# EAGLE design new_remote_pcb (EAGLE 6.6.0)
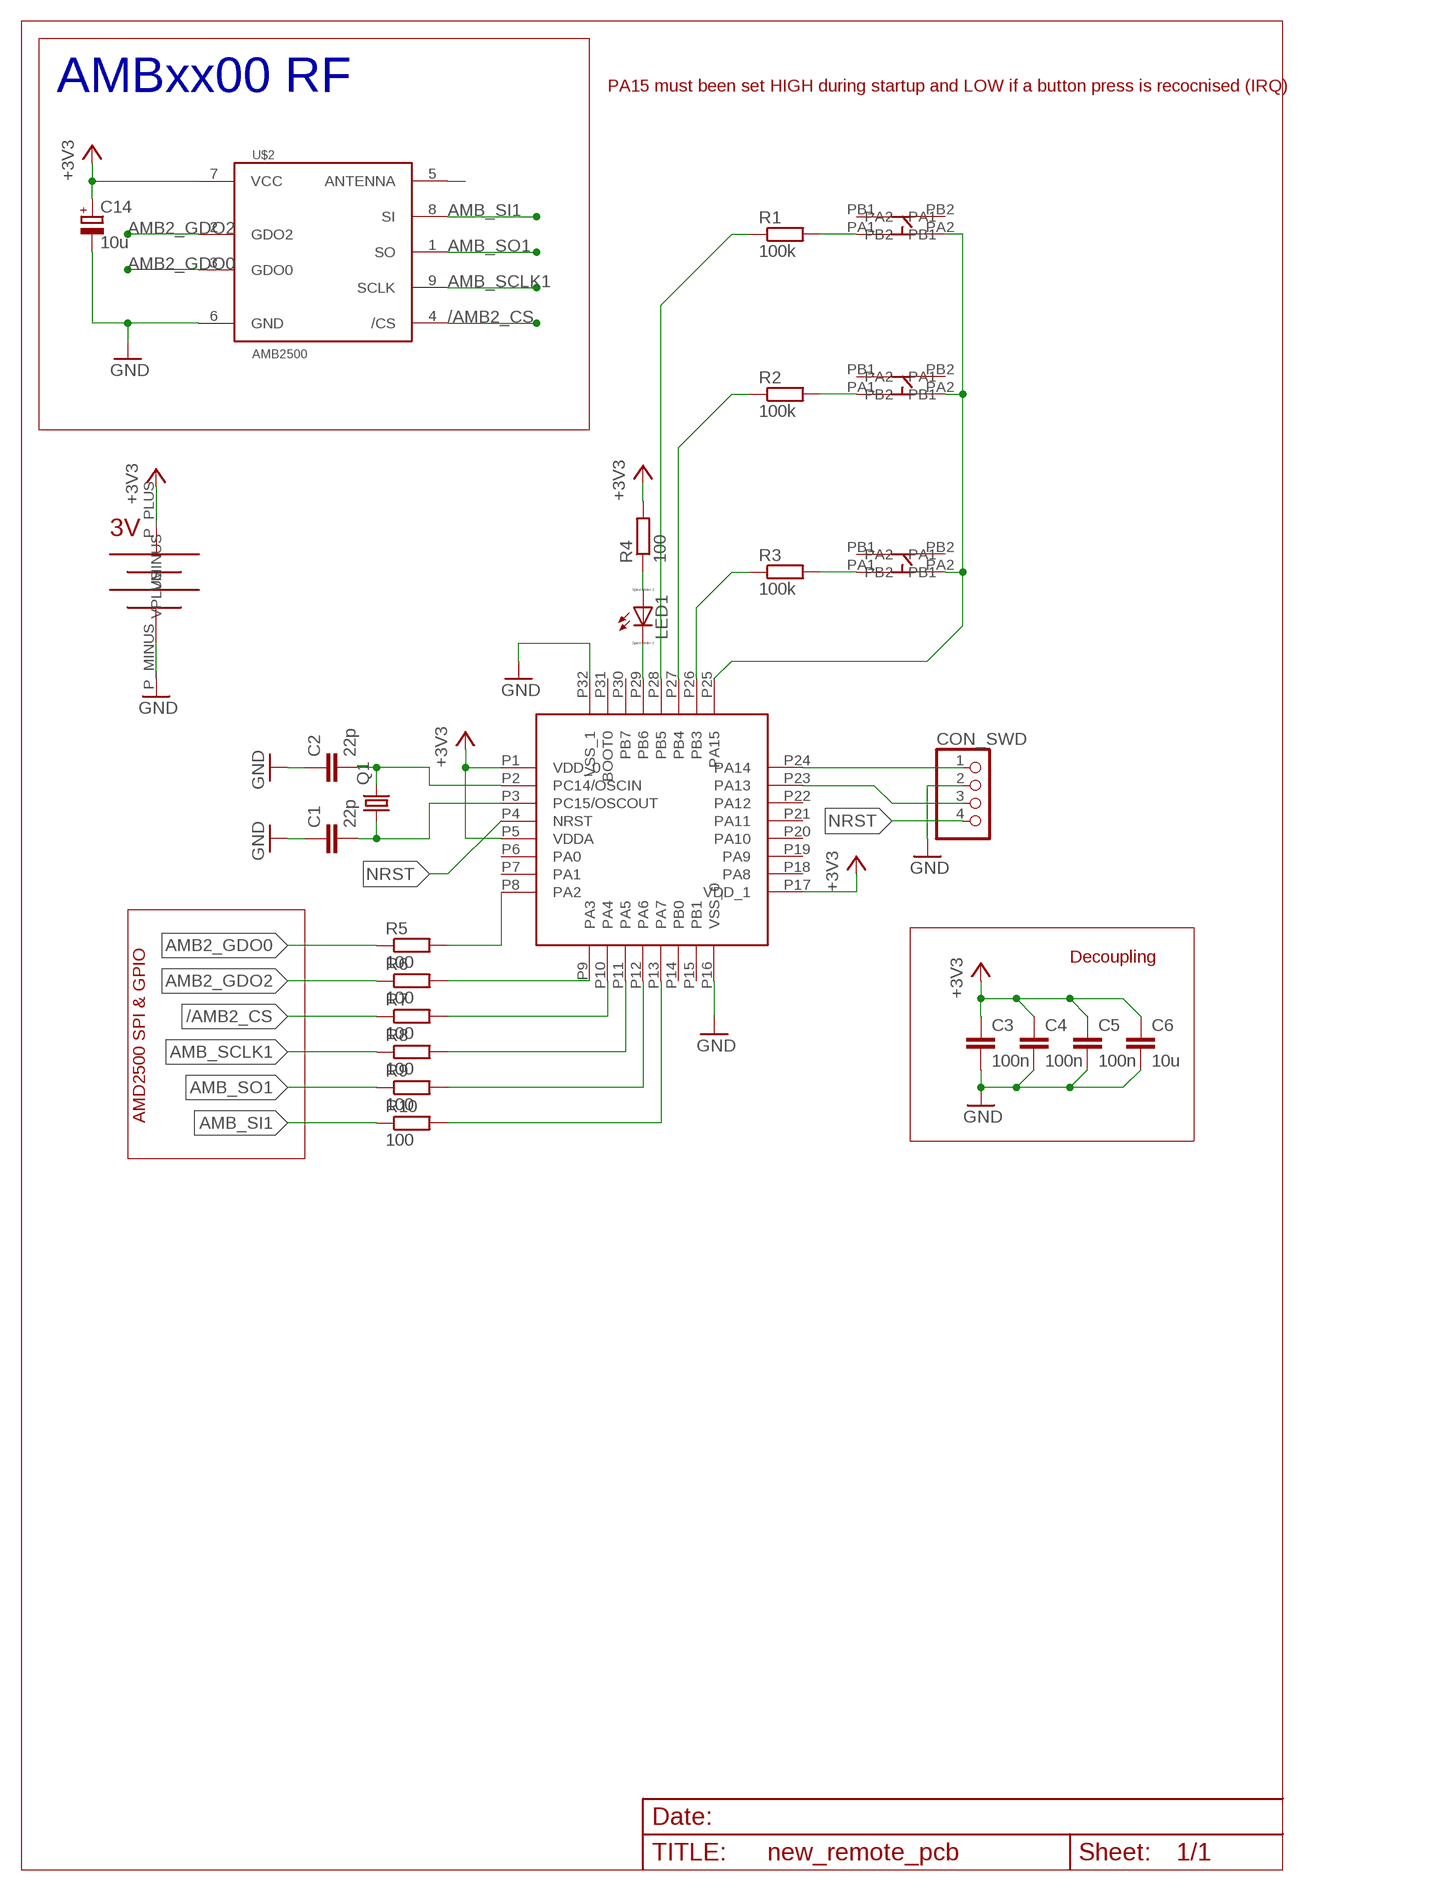
[diagram p0: schematic, sheet 1]

## Parts
C1  22p  C-EUC0805K  [C0805K]
C2  22p  C-EUC0805K  [C0805K]
C3  100n  C-EUC0805  [C0805]
C4  100n  C-EUC0805  [C0805]
C5  100n  C-EUC0805  [C0805]
C6  10u  C-EUC0805  [C0805]
C14  10u  CPOL-EUA/3216-18W  [A/3216-18W]
CON_SWD  PINHD-1X4  [1X04]
LED1  LED_E  [LED_1206]
Q1  CRYSTALHC49UP  [HC49UP]
R1  100k  R-EU_R0805W  [R0805W]
R2  100k  R-EU_R0805W  [R0805W]
R3  100k  R-EU_R0805W  [R0805W]
R4  100  R-EU_R0805W  [R0805W]
R5  100  R-EU_R0805  [R0805]
R6  100  R-EU_R0805  [R0805]
R7  100  R-EU_R0805  [R0805]
R8  100  R-EU_R0805  [R0805]
R9  100  R-EU_R0805  [R0805]
R10  100  R-EU_R0805  [R0805]
U$1  STM32L051K8T6  [LQFP32]
U$2  AMB2500  AMB8400  [AMB8400]
U$3  KEYSTONE_2462  [2462]
U$4  C&K_KSC_BUTTONS  [C&K_KSC9]
U$5  C&K_KSC_BUTTONS  [C&K_KSC9]
U$6  C&K_KSC_BUTTONS  [C&K_KSC9]

## Nets
+3V3: C3.1 C4.1 C5.1 C6.1 C14.+ R4.2 U$1.P1(VDD_0) U$1.P5(VDDA) U$1.P17(VDD_1) U$2.7(VCC) U$3.P_PLUS(VPLUS)
/AMB2_CS: R7.1 U$2.4(/CS)
/AMB2_CS_UC: R7.2 U$1.P10(PA4)
AMB2_GDO0: R5.1 U$2.3(GDO0)
AMB2_GDO0_UC: R5.2 U$1.P8(PA2)
AMB2_GDO2: R6.1 U$2.2(GDO2)
AMB2_GDO2_UC: R6.2 U$1.P9(PA3)
AMB_SCLK1: R8.1 U$2.9(SCLK)
AMB_SCLK1_UC: R8.2 U$1.P11(PA5)
AMB_SI1: R10.1 U$2.8(SI)
AMB_SI1_UC: R10.2 U$1.P13(PA7)
AMB_SO1: R9.1 U$2.1(SO)
AMB_SO1_UC: R9.2 U$1.P12(PA6)
GND: C1.1 C2.1 C3.2 C4.2 C5.2 C6.2 C14.- CON_SWD.2 U$1.P16(VSS_0) U$1.P32(VSS_1) U$2.6(GND) U$3.P_MINUS(VMINUS)
N$1: U$1.P25(PA15) U$4.PA2(PB2) U$5.PA2(PB2) U$6.PA2(PB2)
N$2: R1.2 U$4.PA1(PB1)
N$3: R2.2 U$5.PA1(PB1)
N$4: R3.2 U$6.PA1(PB1)
N$5: R3.1 U$1.P26(PB3)
N$6: R2.1 U$1.P27(PB4)
N$7: R1.1 U$1.P28(PB5)
N$8: LED1.A R4.1
N$9: U$2.5(ANTENNA)
N$10: LED1.C U$1.P29(PB6)
N$11: C1.2 Q1.1 U$1.P3(PC15/OSCOUT)
N$12: C2.2 Q1.2 U$1.P2(PC14/OSCIN)
N$13: CON_SWD.1 U$1.P24(PA14)
N$14: CON_SWD.3 U$1.P23(PA13)
NRST: CON_SWD.4 U$1.P4(NRST)
Unconnected: U$1.P6(PA0) U$1.P7(PA1) U$1.P14(PB0) U$1.P15(PB1) U$1.P18(PA8) U$1.P19(PA9) U$1.P20(PA10) U$1.P21(PA11) U$1.P22(PA12) U$1.P30(PB7) U$1.P31(BOOT0) U$4.PB1(PA1) U$4.PB2(PA2) U$5.PB1(PA1) U$5.PB2(PA2) U$6.PB1(PA1) U$6.PB2(PA2)

## Notes on the sheet
- AMBxx00 RF | PA15 must been set HIGH during startup and LOW if a button press is recocnised (IRQ)
- Decoupling
- AMD2500 SPI & GPIO

## Library data of the parts
C1 C2 = rcl:C-EU: CAPACITOR, European symbol
C3-C6 = resistor:C-EU: CAPACITOR, European symbol
C14 = rcl:CPOL-EU: POLARIZED CAPACITOR, European symbol
CON_SWD = pinhead:PINHD-1X4: PIN HEADER
LED1 = eagle-ltspice:LED_E: LED Source: http://www.osram.convergy.de Source: www.luxeon.com Source: www.kingbright.com; SPICEMODEL: NONE; SPICEPREFIX: D; SPICETYPE: diode
Q1 = crystal:CRYSTAL: CRYSTAL; OC_FARNELL: unknown; OC_NEWARK: unknown
R1-R4 = rcl:R-EU_: RESISTOR, European symbol
R5-R10 = resistor:R-EU_: RESISTOR, European symbol
U$1 = STM32L0xx:STM32L051K8T6
U$2 = Amber-Wireless:AMB8400
U$3 = Battery_holder:KEYSTONE_2462
U$4-U$6 = button:C&K_KSC_BUTTONS

## Board
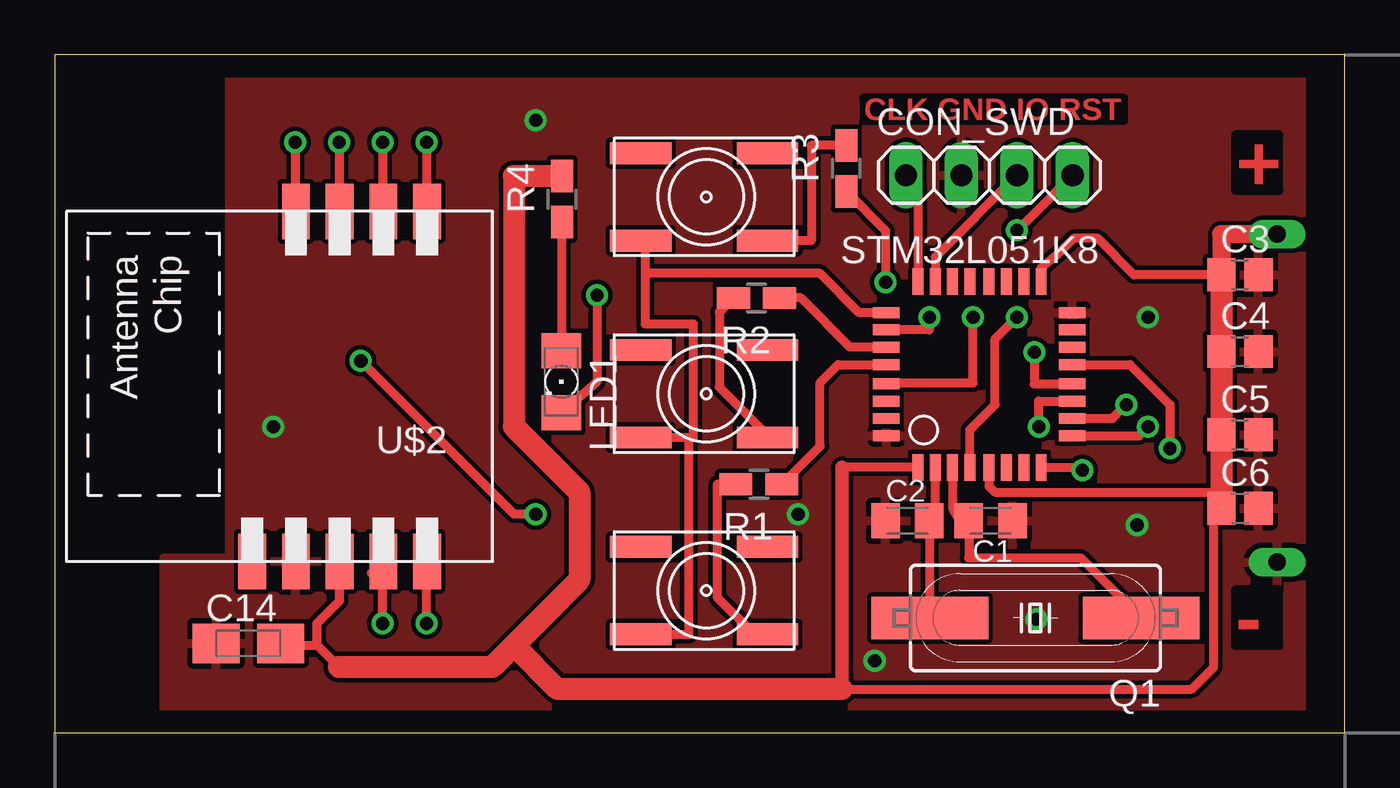
[diagram p1: board, top side]
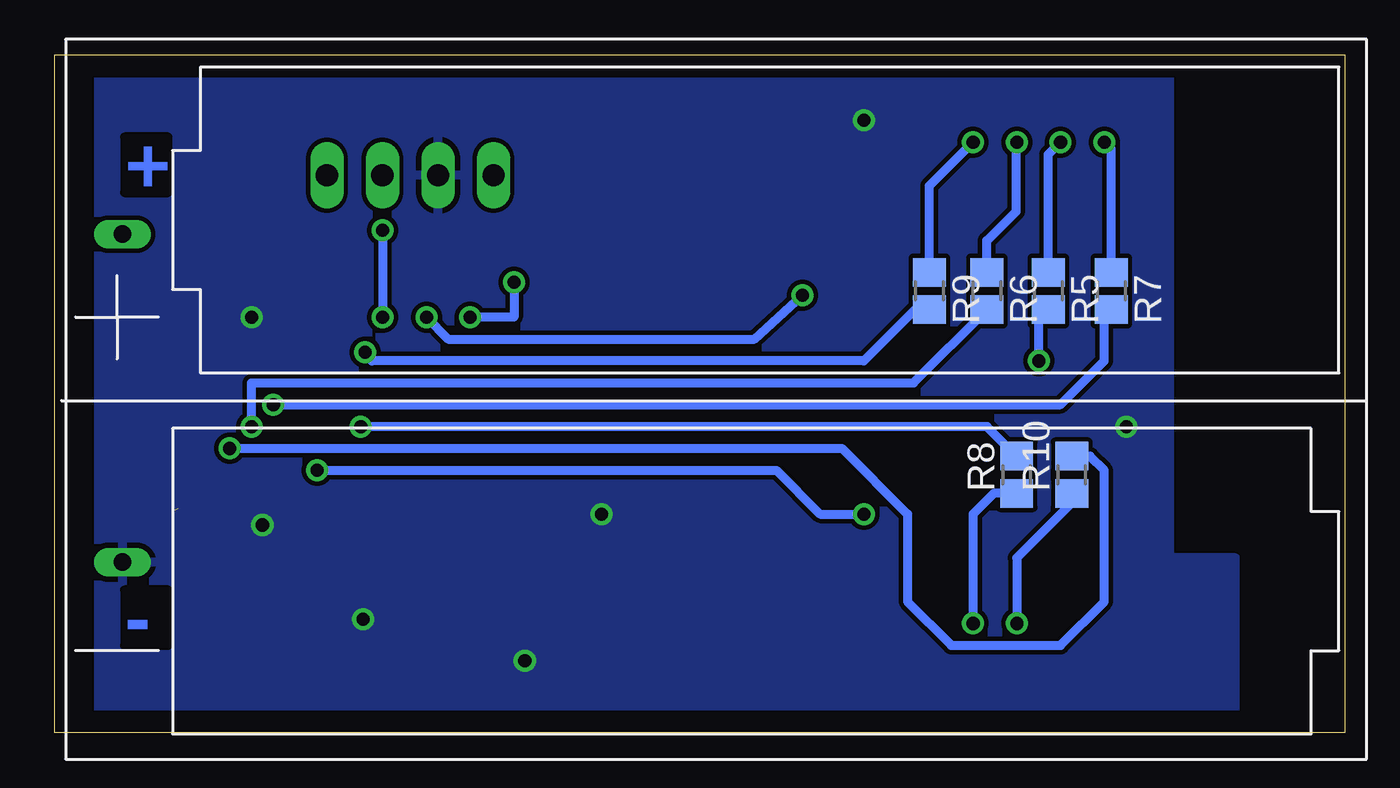
[diagram p2: board, bottom side, seen from below]

Size 59 x 31 mm. Coordinates in mm from the lower left corner, seen from the top.
Outline: 0,0 59,0 59,31 0,31 0,0
Copper layers (1*16): Top 0.035mm / dielectric 1.5mm / Bottom 0.035mm
Design rules "default": minimum track width 10mil, minimum drill 24mil, track to track 8mil, track to pad 8mil, pad to pad 8mil, via to via 8mil, smd to smd 8mil, copper to edge 40mil, drill to drill 8mil, minimum pad ring 10mil, minimum via ring 8mil, stop-mask expansion 4mil, vias tented up to drill 0mil, thermal gap 10mil

### Footprints (pad centres in the part's own frame; a part is rotated, then mirrored left to right if it is on the bottom)
C0805K = smd 1.3 x 1.6: 1 -1,0; 2 1,0
C0805 = smd 1.3 x 1.5: 1 -0.85,0; 2 0.85,0
A/3216-18W = smd 2.15 x 1.8: + 1.475,0; - -1.475,0
1X04 = drill 1.016 long: 1 -3.81,0; 2 -1.27,0; 3 1.27,0; 4 3.81,0
LED_1206 = smd 1.6 x 1.803: A -1.422,0; C 1.422,0
HC49UP = smd 5.334 x 1.93: 1 -4.826,0; 2 4.826,0
R0805W = smd 1.5 x 1: 1 -1.052,0; 2 1.052,0
R0805 = smd 1.3 x 1.5: 1 -0.85,0; 2 0.85,0
LQFP32 = smd 0.5 x 1.2: P1 -2.8,-4.25; P2 -2.01,-4.25; P3 -1.22,-4.25; P4 -0.43,-4.25; P5 0.45,-4.25; P6 1.25,-4.25; P7 2.04,-4.25; P8 2.83,-4.25; P17 2.83,4.25; P18 2.04,4.25; P19 1.25,4.25; P20 0.45,4.25; P21 -0.43,4.25; P22 -1.22,4.25; P23 -2.01,4.25; P24 -2.8,4.25 | smd 1.2 x 0.5: P9 4.25,-2.8; P10 4.25,-2.01; P11 4.25,-1.22; P12 4.25,-0.43; P13 4.25,0.45; P14 4.25,1.25; P15 4.25,2.04; P16 4.25,2.83; P25 -4.25,2.83; P26 -4.25,2.04; P27 -4.25,1.25; P28 -4.25,0.45; P29 -4.25,-0.43; P30 -4.25,-1.22; P31 -4.25,-2.01; P32 -4.25,-2.8
AMB8400 = smd 1.27 x 2.54: 1 -1.77,-8; 2 0.23,-8; 3 2.23,-8; 4 4.23,-8; 5 6.23,8; 6 4.23,8; 7 2.23,8; 8 0.23,8; 9 -1.77,8
2462 = drill 0.8 pad 1.016 long: P_MINUS 56.9,23.9; P_PLUS 56.9,8.9
C&K_KSC9 = smd 2.8 x 1: PA1 1.4,4.5; PA2 7.2,4.5; PB1 1.4,0.5; PB2 7.2,0.5

### Placement (x,y rotation side)
C1  42.8,9.7 180 top
C2  39,9.69 0 top
C3  54.2,20.94 0 top
C4  54.2,17.43 0 top
C5  54.2,13.62 0 top
C6  54.2,10.27 0 top
C14  8.86,4.09 0 top
CON_SWD  42.74,25.49 0 top
LED1  23.17,16.05 270 top
Q1  44.85,5.25 180 top
R1  32.2,11.36 180 top
R2  32.1,19.88 180 top
R3  36.2,25.8 90 top
R4  23.2,24.4 90 top
R5  13.56,20.2 270 bottom
R6  16.37,20.2 270 bottom
R7  10.68,20.2 270 bottom
R8  15.01,11.8 90 bottom
R9  19,20.2 270 bottom
R10  12.49,11.8 90 bottom
U$1  42.28,16.38 0 top
U$2  15.26,15.84 180 top
U$3  -1,31.7 180 bottom
U$4  34,9 180 top
U$5  34,18 180 top
U$6  34,27 180 top

### Tracks (layer width: path | path; a pad name or v marks a point on that pad's centre or on a via)
+3V3  (1 unrouted)
  Top 0.406: C6.1 53.35,11 43,11 42.73,11.27 U$1.P5 | 13,3 12,4 | 12,4 12,5 13.03,6.03 U$2.7 | C14.+ 10.43,4 12,4 | C3.1 49.36,20.94 47.7,22.6 46.6,22.6 46,22 45.11,21.24 U$1.P17 | U$1.P1 36,12.13 | 36,2 52,2 53,3 53,9.7 53.5,10.2
  Top 0.61: 36,12.13 36,2
  Top 0.813: U$3.P_PLUS 53.35,22.8 C3.1
  Top 1.016: C3.1 C4.1 C5.1 53.35,11 | R4.2 21,25.45 21,14 24,11 24,7 21,4 | 21,4 20,3 13,3 | 36,2 23,2 21,4
/AMB2_CS  (via drill 0.6)
  Top 0.406: v11,27 11,23.87 U$2.4
  Bottom 0.406: R7.1 10.68,26.68 v11,27
/AMB2_CS_UC  (via drill 0.6)
  Top 0.406: U$1.P10 48.37,14.37 v49,15
  Bottom 0.406: v49,15 13,15 11,17 11,19.03 R7.2
AMB2_GDO0  (via drill 0.6)
  Top 0.406: v13,27 13,23.87 U$2.3
  Bottom 0.406: R5.1 13.56,26.44 v13,27
AMB2_GDO0_UC  (via drill 0.6)
  Top 0.406: U$1.P8 46.87,12.13 v47,12 | v22,10 21,10 v14,17
  Bottom 0.406: v47,12 26,12 24,10 v22,10 | v14,17 14,18.91 R5.2
AMB2_GDO2  (via drill 0.6)
  Top 0.406: v15,27 15,23.87 U$2.2
  Bottom 0.406: R6.1 16.37,22.5 U$2.2 15.03,26.97 v15,27
AMB2_GDO2_UC  (via drill 0.6)
  Top 0.406: U$1.P9 49.58,13.58 v50,14
  Bottom 0.406: v50,14 50,16 19.72,16 R6.2
AMB_SCLK1  (via drill 0.6)
  Top 0.406: 17.01,7.82 U$2.9 17,7.81 v17,5
  Bottom 0.406: R8.1 16.05,10.95 17,10 v17,5
AMB_SCLK1_UC  (via drill 0.6)
  Top 0.406: v45,14 45,15.16 U$1.P11
  Bottom 0.406: R8.2 16.36,14 v45,14
AMB_SI1  (via drill 0.6)
  Top 0.406: 14.49,7.3 U$2.8 15,7.81 v15,5
  Bottom 0.406: R10.1 12.49,10.51 15,8 v15,5
AMB_SI1_UC  (via drill 0.6)
  Top 0.406: U$1.P13 49.17,16.83 51,15 v51,13
  Bottom 0.406: v51,13 23,13 20,10 20,6 18,4 13,4 11,6 11,12 11.65,12.65 R10.2
AMB_SO1  (via drill 0.6)
  Top 0.406: v17,27 17,23.87 U$2.1
  Bottom 0.406: R9.1 19,25 v17,27
AMB_SO1_UC  (via drill 0.6)
  Top 0.406: v44.8,17.4 44.8,15.95 U$1.P12
  Bottom 0.406: R9.2 19.65,19.35 22,17 44.5,17 v44.8,17.4
GND  (via drill 0.6)
  other vias: 50,19 22,28 10,14 34,10 37.5,3.3 44.9,5.2 49.5,9.5
  pour Top: 9,30 57,30 57,1 5,1 5,8 8,8 8,30
  pour Bottom: 8,30 57,30 57,1 5,1 5,8 8,8
N$1
  Top 0.406: U$1.P25 36.79,19.21 35,21 27,21 | U$6.PA2 27,22.3 27,21 | 27,21 27,18.7 29.2,18.7 29.2,13.5 29,13.5 | 29,13.5 U$5.PA2 | U$4.PA2 29,4.5 29,13.5
N$2
  Top 0.406: R1.2 30.3,11.36 30.3,6.2 32,4.5 U$4.PA1
N$3
  Top 0.406: R2.2 30.4,19.23 30.4,15.8 32.6,13.6 U$5.PA1
N$4
  Top 0.406: R3.2 34.6,26.85 34.6,22.5 U$6.PA1
N$5  (via drill 0.6)
  Top 0.406: R3.1 38,22.95 v38,20.6 | v40,19 40,18.42 U$1.P26
  Bottom 0.406: v38,20.6 38,19 v40,19
N$6
  Top 0.406: U$1.P27 36.37,17.63 34.12,19.88 R2.1
N$7
  Top 0.406: R1.1 35,13.11 35,16 35.83,16.83 U$1.P28
N$8
  Top 0.406: LED1.A 23.2,17.64 R4.1
N$10  (via drill 0.6)
  Top 0.406: U$1.P29 38.03,16 42,16 v42,19 | v24.8,20 24.8,16.06 LED1.C
  Bottom 0.406: v42,19 41,18 27,18 v24.8,20
N$11
  Top 0.406: Q1.1 46.93,8 41.8,8 C1.2 arc-90 41.06,10.44 U$1.P3
N$12
  Top 0.406: Q1.2 40,5.27 C2.2 40.27,9.96 U$1.P2
N$13
  Top 0.406: CON_SWD.1 39.48,24.94 U$1.P24
N$14
  Top 0.406: CON_SWD.3 40.27,21.75 U$1.P23
NRST  (via drill 0.6)
  Top 0.406: U$1.P4 41.85,13.85 43,15 43,18 v44,19 | CON_SWD.4 44.54,23.48 v44,22.98
  Bottom 0.406: v44,22.98 v44,19

### Text on the board
Top: CLK GND IO RST | + | -
Bottom: + | -